# EAGLE schematic AK4493-v1.64_4 (EAGLE 9.6.2)
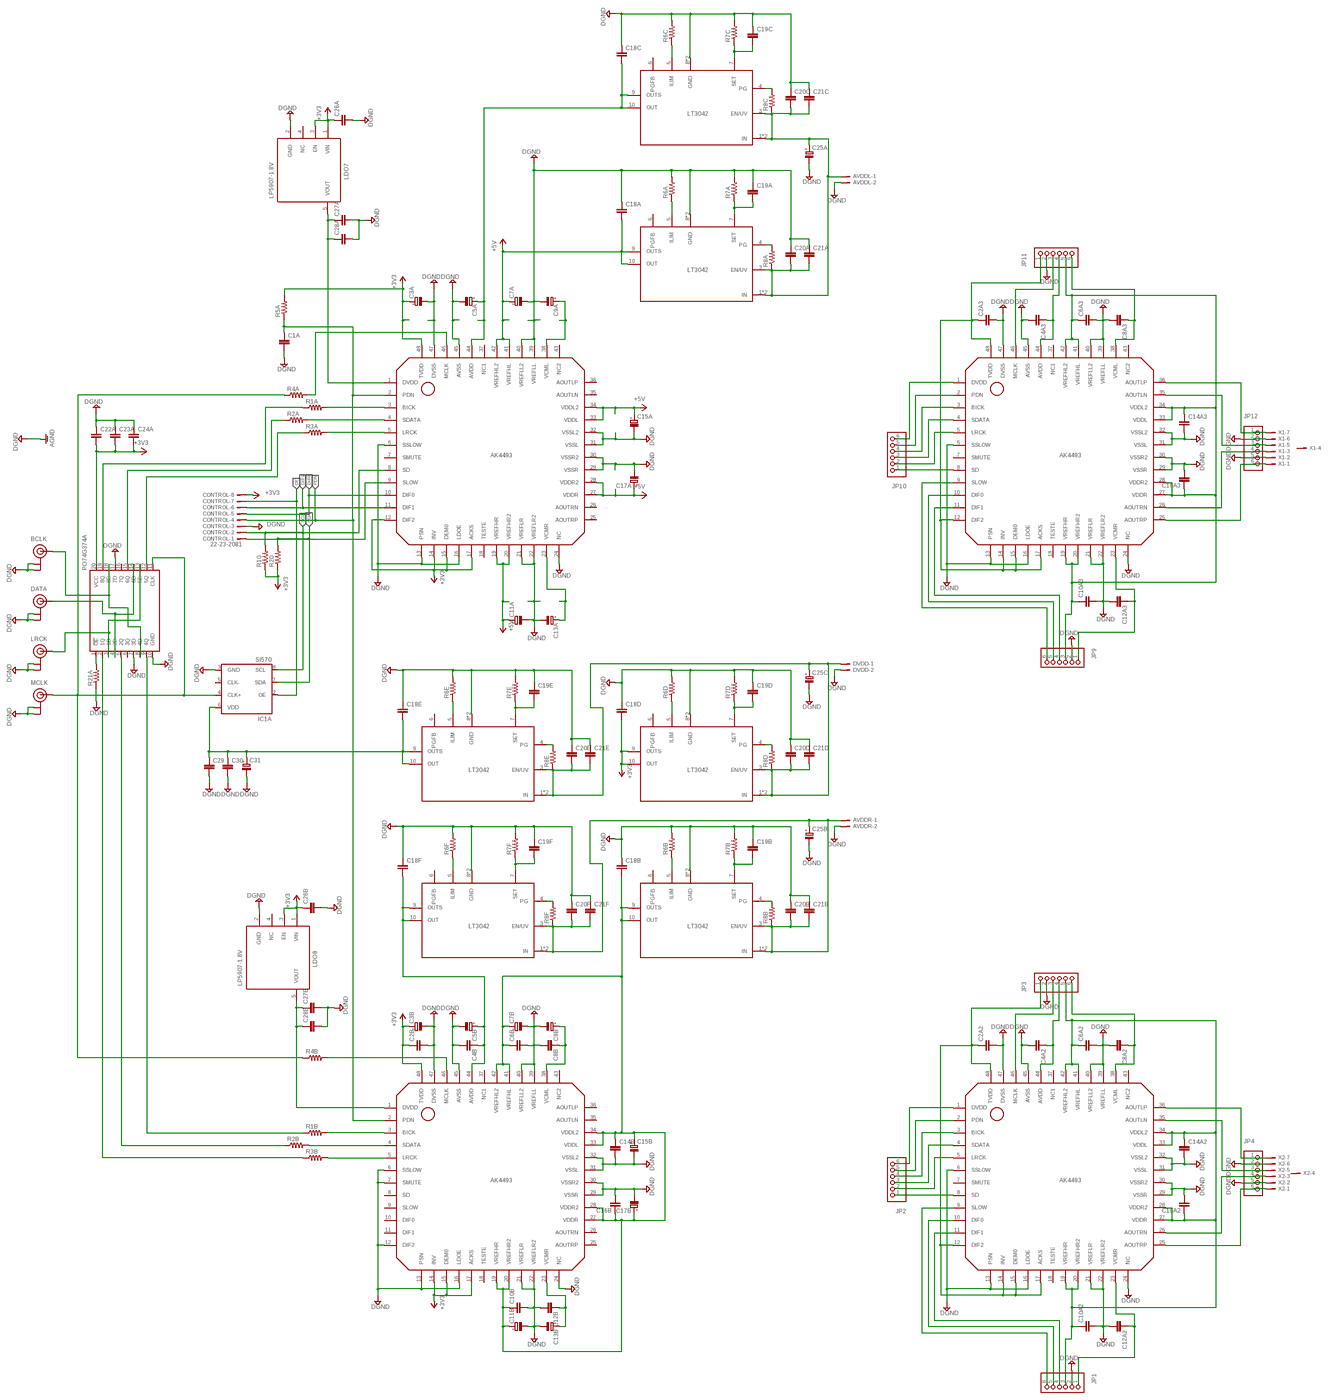
[diagram p0: schematic, sheet 1, overview]
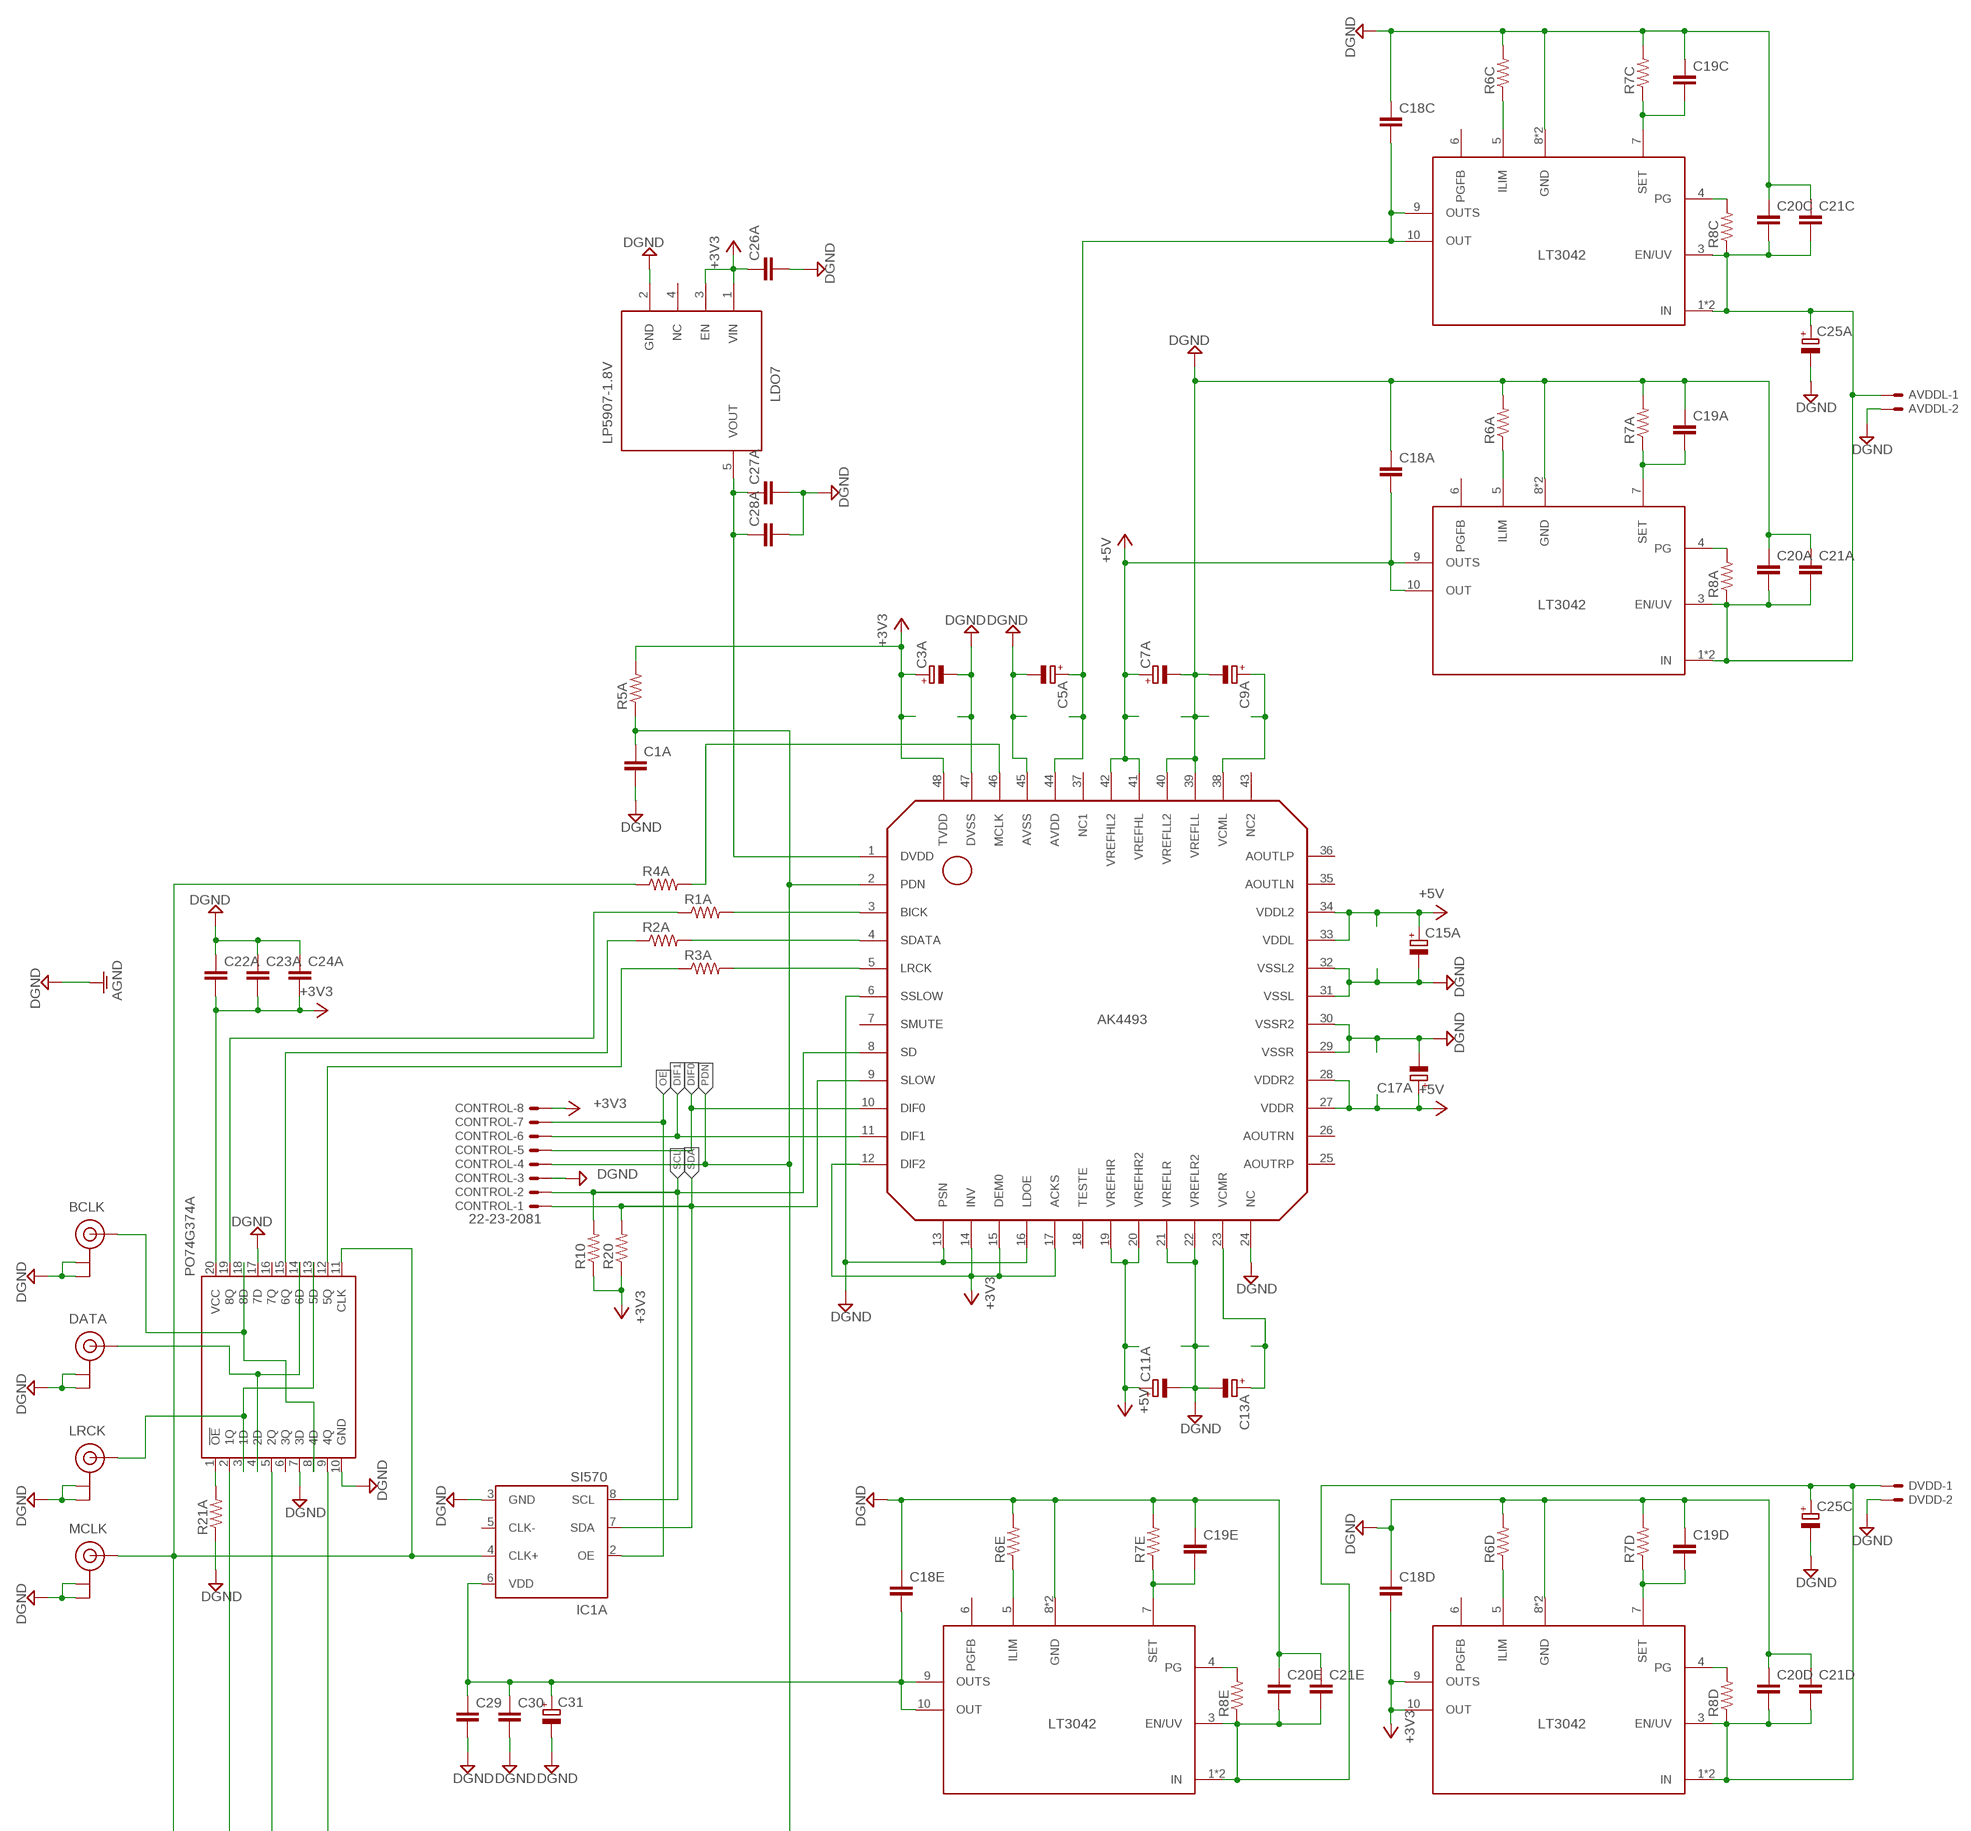
[diagram p1: schematic, sheet 1, part 1 of 4]
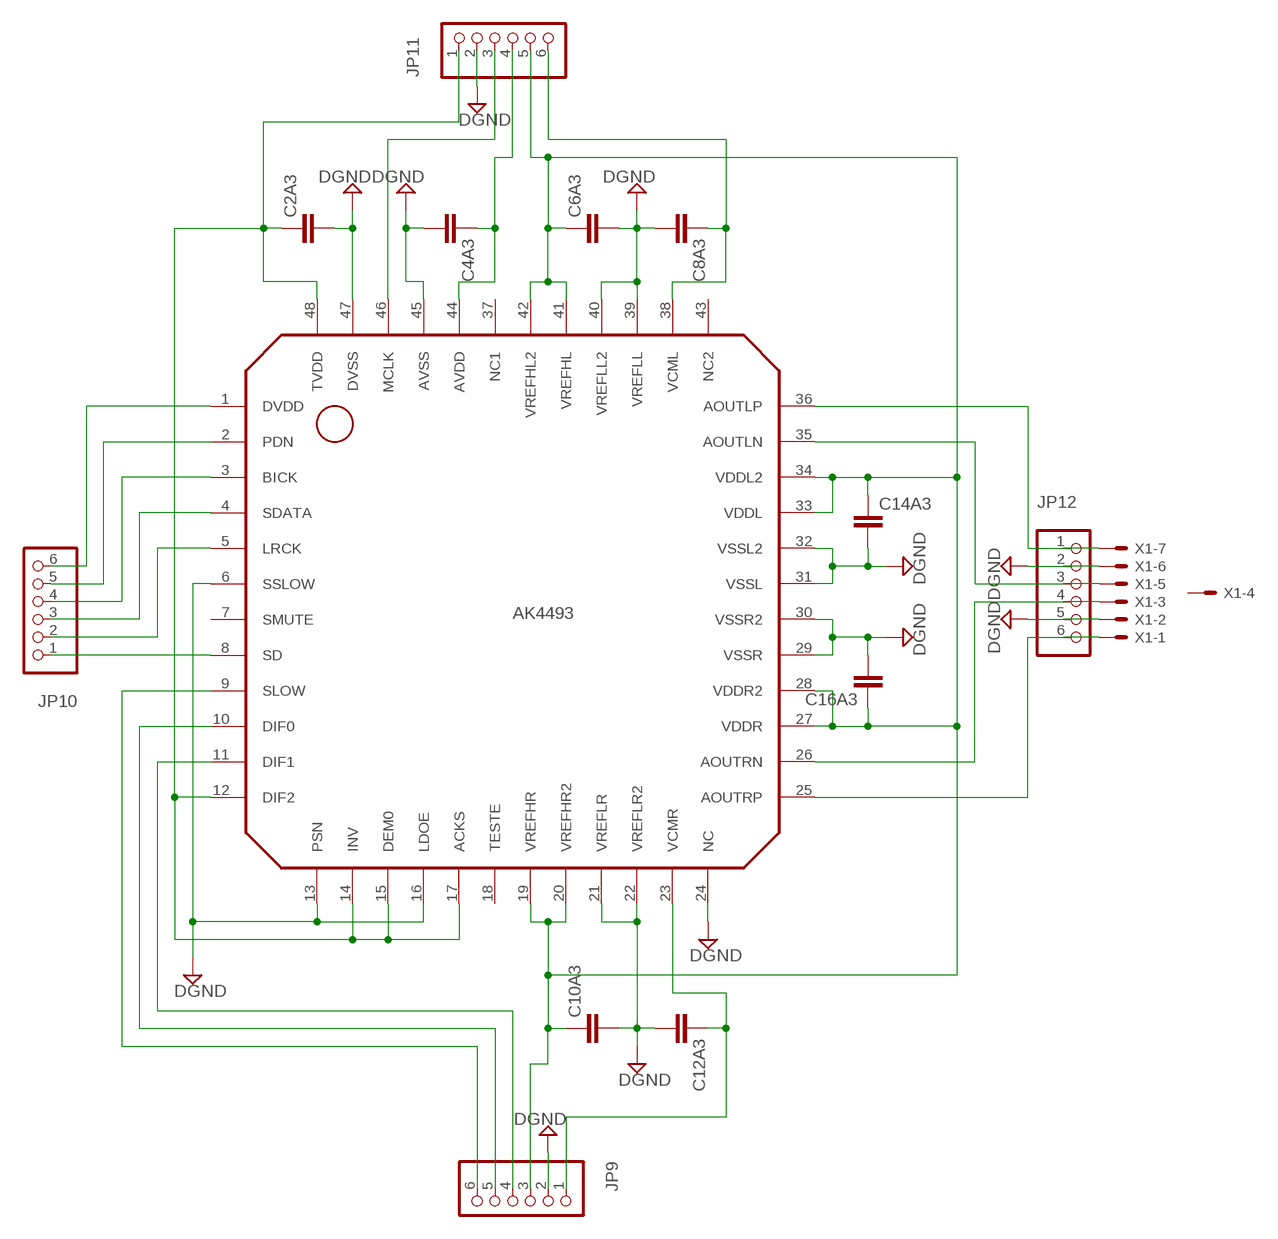
[diagram p2: schematic, sheet 1, part 2 of 4]
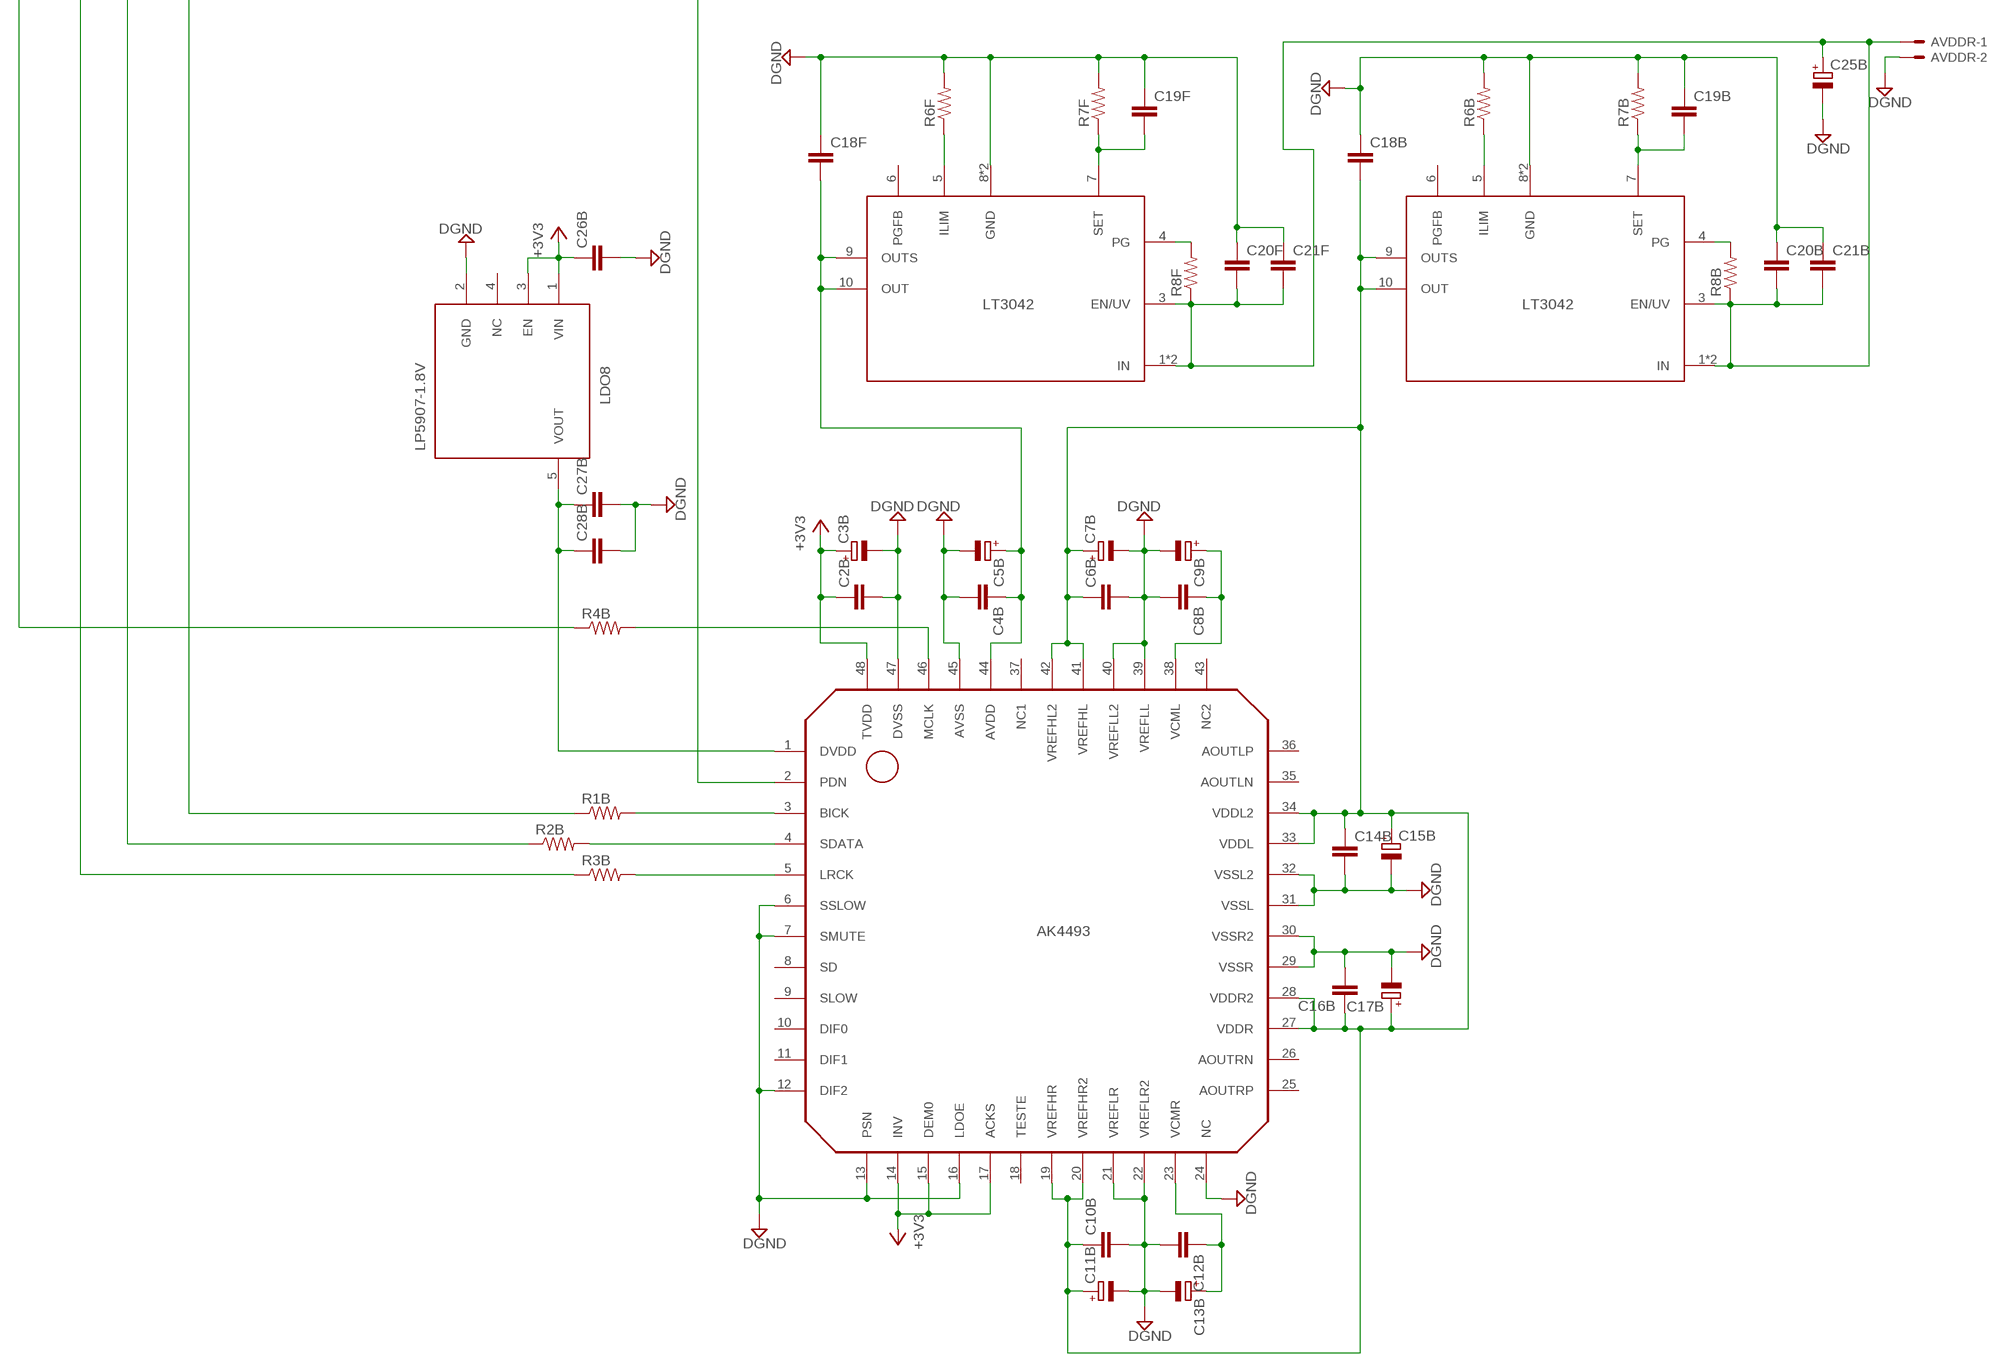
[diagram p3: schematic, sheet 1, part 3 of 4]
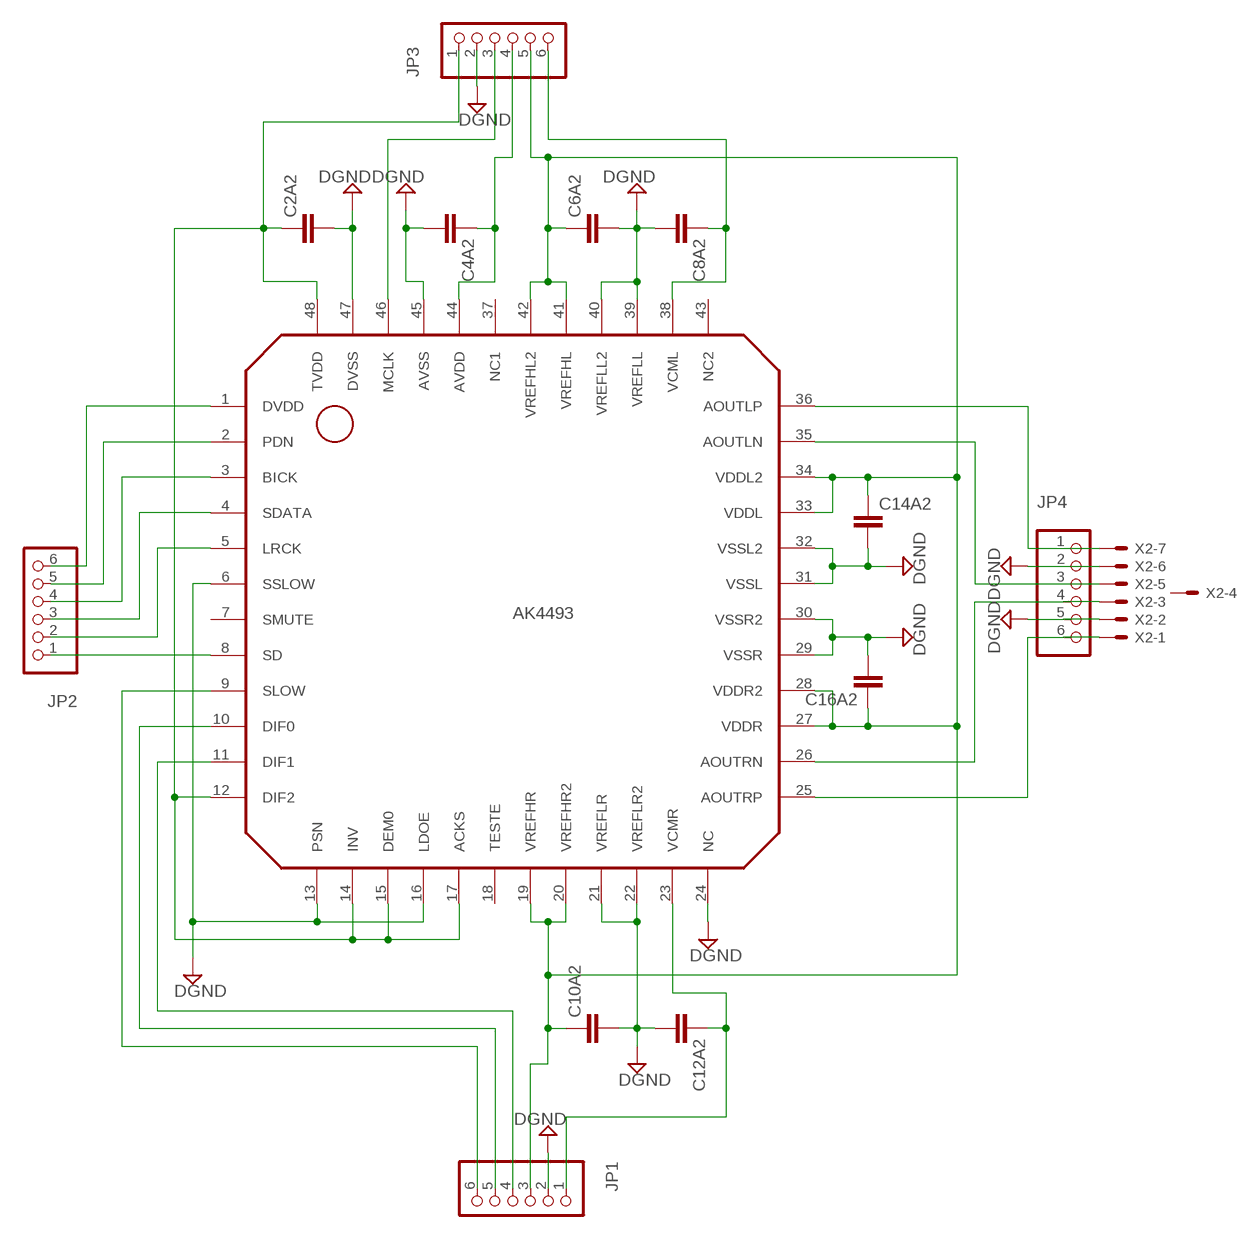
[diagram p4: schematic, sheet 1, part 4 of 4]

## Parts
AVDDL  22-23-2021  [22-23-2021]
AVDDR  22-23-2021  [22-23-2021]
BCLK  U.FL  [U.FL]
C1A  C-EUC0805K  [C0805K]
C2A2  C-EUC0201  [C0201]
C2A3  C-EUC0201  [C0201]
C2B  C-EUC0603K  [C0603K]
C3A  CPOL-EUE2.5-5  [E2,5-5]
C3B  CPOL-EUE2.5-5  [E2,5-5]
C4A2  C-EUC0201  [C0201]
C4A3  C-EUC0201  [C0201]
C4B  C-EUC0603K  [C0603K]
C5A  CPOL-EUE2.5-5  [E2,5-5]
C5B  CPOL-EUE2.5-5  [E2,5-5]
C6A2  C-EUC0201  [C0201]
C6A3  C-EUC0201  [C0201]
C6B  C-EUC0603K  [C0603K]
C7A  CPOL-EUE5-8.5  [E5-8,5]
C7B  CPOL-EUE5-8.5  [E5-8,5]
C8A2  C-EUC0201  [C0201]
C8A3  C-EUC0201  [C0201]
C8B  C-EUC0603K  [C0603K]
C9A  CPOL-EUE2-4  [E2-4]
C9B  CPOL-EUE2-4  [E2-4]
C10A2  C-EUC0201  [C0201]
C10A3  C-EUC0201  [C0201]
C10B  C-EUC0603K  [C0603K]
C11A  CPOL-EUE5-8.5  [E5-8,5]
C11B  CPOL-EUE5-8.5  [E5-8,5]
C12A2  C-EUC0201  [C0201]
C12A3  C-EUC0201  [C0201]
C12B  C-EUC0603K  [C0603K]
C13A  CPOL-EUE2-4  [E2-4]
C13B  CPOL-EUE2-4  [E2-4]
C14A2  C-EUC0201  [C0201]
C14A3  C-EUC0201  [C0201]
C14B  C-EUC0603K  [C0603K]
C15A  CPOL-EUE2-4  [E2-4]
C15B  CPOL-EUE2-4  [E2-4]
C16A2  C-EUC0201  [C0201]
C16A3  C-EUC0201  [C0201]
C16B  C-EUC0603K  [C0603K]
C17A  CPOL-EUE2-4  [E2-4]
C17B  CPOL-EUE2-4  [E2-4]
C18A  C-EUC0805K  [C0805K]
C18B  C-EUC0805K  [C0805K]
C18C  C-EUC0805K  [C0805K]
C18D  C-EUC0805K  [C0805K]
C18E  C-EUC0805K  [C0805K]
C18F  C-EUC0805K  [C0805K]
C19A  C-EUC1206K  [C1206K]
C19B  C-EUC1206K  [C1206K]
C19C  C-EUC1206K  [C1206K]
C19D  C-EUC1206K  [C1206K]
C19E  C-EUC1206K  [C1206K]
C19F  C-EUC1206K  [C1206K]
C20A  C-EUC0805K  [C0805K]
C20B  C-EUC0805K  [C0805K]
C20C  C-EUC0805K  [C0805K]
C20D  C-EUC0805K  [C0805K]
C20E  C-EUC0805K  [C0805K]
C20F  C-EUC0805K  [C0805K]
C21A  C-EUC0805K  [C0805K]
C21B  C-EUC0805K  [C0805K]
C21C  C-EUC0805K  [C0805K]
C21D  C-EUC0805K  [C0805K]
C21E  C-EUC0805K  [C0805K]
C21F  C-EUC0805K  [C0805K]
C22A  C-EUC0603K  [C0603K]
C23A  C-EUC0603K  [C0603K]
C24A  C-EUC0603K  [C0603K]
C25A  CPOL-EUE2.5-7  [E2,5-7]
C25B  CPOL-EUE2.5-7  [E2,5-7]
C25C  CPOL-EUE2.5-7  [E2,5-7]
C26A  C-EUC0805K  [C0805K]
C26B  C-EUC0805K  [C0805K]
C27A  C-EUC0805K  [C0805K]
C27B  C-EUC0805K  [C0805K]
C28A  C-EUC0603K  [C0603K]
C28B  C-EUC0603K  [C0603K]
C29  C-EUC0603K  [C0603K]
C30  C-EUC0805K  [C0805K]
C31  CPOL-EUE2.5-5  [E2,5-5]
CONTROL  22-23-2081  [22-23-2081]
DATA  U.FL  [U.FL]
DVDD  22-23-2021  [22-23-2021]
IC1  LT3042  [SOP50P490X110-11N]
IC1A  SI570  [8-PIN]
IC2  AK4493  [LQFP48]
IC3A  AK4493  [LQFP48]
IC4  LT3042  [SOP50P490X110-11N]
IC4A  PO74G374A  [SOP65P640X120-20N]
IC5  LT3042  [SOP50P490X110-11N]
IC6  LT3042  [SOP50P490X110-11N]
IC7  LT3042  [SOP50P490X110-11N]
IC8  LT3042  [SOP50P490X110-11N]
IC9  AK4493  [LQFP48]
IC10  AK4493  [LQFP48]
JP1  PINHD-1X6  [1X06]
JP2  PINHD-1X6  [1X06]
JP3  PINHD-1X6  [1X06]
JP4  PINHD-1X6  [1X06]
JP9  PINHD-1X6  [1X06]
JP10  PINHD-1X6  [1X06]
JP11  PINHD-1X6  [1X06]
JP12  PINHD-1X6  [1X06]
LDO7  LP5907-1.8V  [SOT95P280X145-5N]
LDO8  LP5907-1.8V  [SOT95P280X145-5N]
LRCK  U.FL  [U.FL]
MCLK  U.FL  [U.FL]
R1A  R-US_R0603  [R0603]
R1B  R-US_R0603  [R0603]
R2A  R-US_R0603  [R0603]
R2B  R-US_R0603  [R0603]
R3A  R-US_R0603  [R0603]
R3B  R-US_R0603  [R0603]
R4A  R-US_R0603  [R0603]
R4B  R-US_R0603  [R0603]
R5A  R-US_R0805  [R0805]
R6A  R-US_R0805  [R0805]
R6B  R-US_R0805  [R0805]
R6C  R-US_R0805  [R0805]
R6D  R-US_R0805  [R0805]
R6E  R-US_R0805  [R0805]
R6F  R-US_R0805  [R0805]
R7A  R-US_R0805  [R0805]
R7B  R-US_R0805  [R0805]
R7C  R-US_R0805  [R0805]
R7D  R-US_R0805  [R0805]
R7E  R-US_R0805  [R0805]
R7F  R-US_R0805  [R0805]
R8A  R-US_R0805  [R0805]
R8B  R-US_R0805  [R0805]
R8C  R-US_R0805  [R0805]
R8D  R-US_R0805  [R0805]
R8E  R-US_R0805  [R0805]
R8F  R-US_R0805  [R0805]
R10  R-US_R0805  [R0805]
R20  R-US_R0805  [R0805]
R21A  R-US_R0805  [R0805]
X1  22-23-2071  [22-23-2071]
X2  22-23-2071  [22-23-2071]

## Nets
+3V3: C2B.1 C3A.+ C3B.+ C18D.2 C22A.2 C23A.2 C24A.2 C26A.1 C26B.1 CONTROL.8 IC2.12(DIF2) IC2.14(INV) IC2.15(DEM0) IC2.17(ACKS) IC2.48(TVDD) IC3A.14(INV) IC3A.15(DEM0) IC3A.17(ACKS) IC3A.48(TVDD) IC4A.20(VCC) IC5.9(OUTS) IC5.10(OUT) LDO7.1(VIN) LDO7.3(EN) LDO8.1(VIN) LDO8.3(EN) R5A.2 R10.1 R20.1
+5V: C7A.+ C11A.+ C15A.+ C17A.+ C18A.2 IC2.19(VREFHR) IC2.20(VREFHR2) IC2.27(VDDR) IC2.28(VDDR2) IC2.33(VDDL) IC2.34(VDDL2) IC2.41(VREFHL) IC2.42(VREFHL2) IC8.9(OUTS) IC8.10(OUT)
DGND: AVDDL.2 AVDDR.2 BCLK.1(GND) BCLK.2(GND) C1A.2 C2A2.2 C2A3.2 C2B.2 C3A.- C3B.- C4A2.2 C4A3.2 C4B.2 C5A.- C5B.- C6A2.2 C6A3.2 C6B.2 C7A.- C7B.- C8A2.2 C8A3.2 C8B.2 C9A.- C9B.- C10A2.2 C10A3.2 C10B.2 C11A.- C11B.- C12A2.2 C12A3.2 C12B.2 C13A.- C13B.- C14A2.2 C14A3.2 C14B.2 C15A.- C15B.- C16A2.2 C16A3.2 C16B.2 C17A.- C17B.- C18A.1 C18B.1 C18C.1 C18D.1 C18E.1 C18F.1 C19A.1 C19B.1 C19C.1 C19D.1 C19E.1 C19F.1 C20A.1 C20B.1 C20C.1 C20D.1 C20E.1 C20F.1 C21A.1 C21B.1 C21C.1 C21D.1 C21E.1 C21F.1 C22A.1 C23A.1 C24A.1 C25A.- C25B.- C25C.- C26A.2 C26B.2 C27A.2 C27B.2 C28A.2 C28B.2 C29.2 C30.2 C31.- CONTROL.3 DATA.1(GND) DATA.2(GND) DVDD.2 IC1.8(GND) IC1.11(GND) IC1A.3(GND) IC2.6(SSLOW) IC2.13(PSN) IC2.16(LDOE) IC2.21(VREFLR) IC2.22(VREFLR2) IC2.24(NC) IC2.29(VSSR) IC2.30(VSSR2) IC2.31(VSSL) IC2.32(VSSL2) IC2.39(VREFLL) IC2.40(VREFLL2) IC2.45(AVSS) IC2.47(DVSS) IC3A.6(SSLOW) IC3A.7(SMUTE) IC3A.12(DIF2) IC3A.13(PSN) IC3A.16(LDOE) IC3A.21(VREFLR) IC3A.22(VREFLR2) IC3A.24(NC) IC3A.29(VSSR) IC3A.30(VSSR2) IC3A.31(VSSL) IC3A.32(VSSL2) IC3A.39(VREFLL) IC3A.40(VREFLL2) IC3A.45(AVSS) IC3A.47(DVSS) IC4.8(GND) IC4.11(GND) IC4A.7(3D) IC4A.10(GND) IC4A.17(7D) IC5.8(GND) IC5.11(GND) IC6.8(GND) IC6.11(GND) IC7.8(GND) IC7.11(GND) IC8.8(GND) IC8.11(GND) IC9.6(SSLOW) IC9.13(PSN) IC9.16(LDOE) IC9.21(VREFLR) IC9.22(VREFLR2) IC9.24(NC) IC9.29(VSSR) IC9.30(VSSR2) IC9.31(VSSL) IC9.32(VSSL2) IC9.39(VREFLL) IC9.40(VREFLL2) IC9.45(AVSS) IC9.47(DVSS) IC10.6(SSLOW) IC10.13(PSN) IC10.16(LDOE) IC10.21(VREFLR) IC10.22(VREFLR2) IC10.24(NC) IC10.29(VSSR) IC10.30(VSSR2) IC10.31(VSSL) IC10.32(VSSL2) IC10.39(VREFLL) IC10.40(VREFLL2) IC10.45(AVSS) IC10.47(DVSS) JP1.2 JP3.2 JP9.2 JP11.2 LDO7.2(GND) LDO8.2(GND) LRCK.1(GND) LRCK.2(GND) MCLK.1(GND) MCLK.2(GND) R6A.2 R6B.2 R6C.2 R6D.2 R6E.2 R6F.2 R7A.2 R7B.2 R7C.2 R7D.2 R7E.2 R7F.2 R21A.1
DIF0: CONTROL.5 IC2.10(DIF0)
DIF1: CONTROL.6 IC2.11(DIF1)
N$1: IC1A.4(CLK+) IC4A.11(CLK) MCLK.FEED(SIGNAL) R4A.1 R4B.1
N$2: IC10.26(AOUTRN) JP12.4 X1.3
N$3: IC9.26(AOUTRN) JP4.4 X2.3
N$4: IC4A.3(1D) IC4A.13(5D) LRCK.FEED(SIGNAL)
N$5: DATA.FEED(SIGNAL) IC4A.4(2D) IC4A.14(6D)
N$8: BCLK.FEED(SIGNAL) IC4A.8(4D) IC4A.18(8D)
N$17: JP4.5 X2.2 ; supply symbol labelled DGND
N$18: C9A.+ IC2.38(VCML)
N$19: IC2.5(LRCK) R3A.2
N$20: IC2.4(SDATA) R2A.2
N$21: IC2.3(BICK) R1A.2
N$22: IC2.46(MCLK) R4A.2
N$23: IC4A.19(8Q) R1A.1
N$24: IC4A.15(6Q) R2A.1
N$25: IC4A.12(5Q) R3A.1
N$26: IC3A.46(MCLK) R4B.2
N$27: IC3A.3(BICK) R1B.2
N$28: IC3A.4(SDATA) R2B.2
N$29: IC3A.5(LRCK) R3B.2
N$30: IC4A.9(4Q) R1B.1
N$31: IC4A.5(2Q) R2B.1
N$32: IC4A.2(1Q) R3B.1
N$33: IC4A.1(!OE) R21A.2
N$34: C6B.1 C7B.+ C10B.1 C11B.+ C14B.1 C15B.+ C16B.1 C17B.+ C18B.2 IC3A.19(VREFHR) IC3A.20(VREFHR2) IC3A.27(VDDR) IC3A.28(VDDR2) IC3A.33(VDDL) IC3A.34(VDDL2) IC3A.41(VREFHL) IC3A.42(VREFHL2) IC6.9(OUTS) IC6.10(OUT)
N$35: IC7.5(ILIM) R6C.1
N$36: C19C.2 IC7.7(SET) R7C.1
N$37: C27A.1 C28A.1 IC2.1(DVDD) LDO7.5(VOUT)
N$38: IC1.5(ILIM) R6F.1
N$39: IC7.4(PG) R8C.2
N$40: AVDDL.1 C20A.2 C20C.2 C21A.2 C21C.2 C25A.+ IC7.1(IN) IC7.2(IN) IC7.3(EN/UV) IC8.1(IN) IC8.2(IN) IC8.3(EN/UV) R8A.1 R8C.1
N$41: IC8.5(ILIM) R6A.1
N$42: C19A.2 IC8.7(SET) R7A.1
N$43: IC8.4(PG) R8A.2
N$44: JP4.2 X2.6 ; supply symbol labelled DGND
N$45: C5A.+ C18C.2 IC2.44(AVDD) IC7.9(OUTS) IC7.10(OUT)
N$46: C4B.1 C5B.+ C18F.2 IC1.9(OUTS) IC1.10(OUT) IC3A.44(AVDD)
N$47: C18E.2 C29.1 C30.1 C31.+ IC1A.6(VDD) IC4.9(OUTS) IC4.10(OUT)
N$48: IC4.5(ILIM) R6E.1
N$49: C19E.2 IC4.7(SET) R7E.1
N$50: IC4.4(PG) R8E.2
N$51: C12B.1 C13B.+ IC3A.23(VCMR)
N$52: C8B.1 C9B.+ IC3A.38(VCML)
N$53: C19F.2 IC1.7(SET) R7F.1
N$54: IC1.4(PG) R8F.2
N$57: IC5.5(ILIM) R6D.1
N$58: C19D.2 IC5.7(SET) R7D.1
N$59: IC5.4(PG) R8D.2
N$60: C20D.2 C20E.2 C21D.2 C21E.2 C25C.+ DVDD.1 IC4.1(IN) IC4.2(IN) IC4.3(EN/UV) IC5.1(IN) IC5.2(IN) IC5.3(EN/UV) R8D.1 R8E.1
N$61: IC6.5(ILIM) R6B.1
N$62: IC6.4(PG) R8B.2
N$63: AVDDR.1 C20B.2 C20F.2 C21B.2 C21F.2 C25B.+ IC1.1(IN) IC1.2(IN) IC1.3(EN/UV) IC6.1(IN) IC6.2(IN) IC6.3(EN/UV) R8B.1 R8F.1
N$64: C19B.2 IC6.7(SET) R7B.1
N$65: JP12.5 X1.2 ; supply symbol labelled DGND
N$66: C27B.1 C28B.1 IC3A.1(DVDD) LDO8.5(VOUT)
N$67: JP12.2 X1.6 ; supply symbol labelled DGND
N$70: C13A.+ IC2.23(VCMR)
N$77 [L_Audio]: IC9.35(AOUTLN) JP4.3 X2.5
N$80: IC9.8(SD) JP2.1
N$81: IC9.9(SLOW) JP1.6
N$82 [L_Audio]: IC10.36(AOUTLP) JP12.1 X1.7
N$83 [L_Audio]: IC10.35(AOUTLN) JP12.3 X1.5
N$84 [R_Audio]: IC10.25(AOUTRP) JP12.6 X1.1
N$85: IC9.11(DIF1) JP1.4
N$86: IC9.10(DIF0) JP1.5
N$87: IC9.5(LRCK) JP2.2
N$88: IC9.4(SDATA) JP2.3
N$89: IC9.3(BICK) JP2.4
N$90: IC9.46(MCLK) JP3.3
N$91: IC9.1(DVDD) JP2.6
N$92: C4A2.1 IC9.44(AVDD) JP3.4
N$93: IC9.2(PDN) JP2.5
N$94: C8A2.1 IC9.38(VCML) JP3.6
N$95: C12A2.1 IC9.23(VCMR) JP1.1
N$96: C2A2.1 IC9.12(DIF2) IC9.14(INV) IC9.15(DEM0) IC9.17(ACKS) IC9.48(TVDD) JP3.1
N$97: C6A2.1 C10A2.1 C14A2.1 C16A2.1 IC9.19(VREFHR) IC9.20(VREFHR2) IC9.27(VDDR) IC9.28(VDDR2) IC9.33(VDDL) IC9.34(VDDL2) IC9.41(VREFHL) IC9.42(VREFHL2) JP1.3 JP3.5
N$99 [L_Audio]: IC9.36(AOUTLP) JP4.1 X2.7
N$100: IC10.8(SD) JP10.1
N$101 [R_Audio]: IC9.25(AOUTRP) JP4.6 X2.1
N$102: IC10.9(SLOW) JP9.6
N$103: IC10.11(DIF1) JP9.4
N$104: IC10.10(DIF0) JP9.5
N$105: IC10.5(LRCK) JP10.2
N$106: IC10.4(SDATA) JP10.3
N$107: IC10.3(BICK) JP10.4
N$108: IC10.46(MCLK) JP11.3
N$109: IC10.1(DVDD) JP10.6
N$110: C4A3.1 IC10.44(AVDD) JP11.4
N$111: IC10.2(PDN) JP10.5
N$112: C8A3.1 IC10.38(VCML) JP11.6
N$113: C12A3.1 IC10.23(VCMR) JP9.1
N$114: C2A3.1 IC10.12(DIF2) IC10.14(INV) IC10.15(DEM0) IC10.17(ACKS) IC10.48(TVDD) JP11.1
N$115: C6A3.1 C10A3.1 C14A3.1 C16A3.1 IC10.19(VREFHR) IC10.20(VREFHR2) IC10.27(VDDR) IC10.28(VDDR2) IC10.33(VDDL) IC10.34(VDDL2) IC10.41(VREFHL) IC10.42(VREFHL2) JP9.3 JP11.5
OE: CONTROL.7 IC1A.2(OE)
PDN: C1A.1 CONTROL.4 IC2.2(PDN) IC3A.2(PDN) R5A.1
SCL: CONTROL.2 IC1A.8(SCL) IC2.8(SD) R10.2
SDA: CONTROL.1 IC1A.7(SDA) IC2.9(SLOW) R20.2
Unconnected: IC1.6(PGFB) IC1A.5(CLK-) IC2.7(SMUTE) IC2.18(TESTE) IC2.25(AOUTRP) IC2.26(AOUTRN) IC2.35(AOUTLN) IC2.36(AOUTLP) IC2.37(NC1) IC2.43(NC2) IC3A.8(SD) IC3A.9(SLOW) IC3A.10(DIF0) IC3A.11(DIF1) IC3A.18(TESTE) IC3A.25(AOUTRP) IC3A.26(AOUTRN) IC3A.35(AOUTLN) IC3A.36(AOUTLP) IC3A.37(NC1) IC3A.43(NC2) IC4.6(PGFB) IC4A.6(3Q) IC4A.16(7Q) IC5.6(PGFB) IC6.6(PGFB) IC7.6(PGFB) IC8.6(PGFB) IC9.7(SMUTE) IC9.18(TESTE) IC9.37(NC1) IC9.43(NC2) IC10.7(SMUTE) IC10.18(TESTE) IC10.37(NC1) IC10.43(NC2) LDO7.4(NC) LDO8.4(NC) X1.4 X2.4

## Library data of the parts
AVDDL AVDDR DVDD = con-molex:22-23-2021: .100" (2.54mm) Center Header - 2 Pin; MF: MOLEX; MPN: 22-23-2021; OC_FARNELL: 1462926; OC_NEWARK: 25C3832
BCLK DATA LRCK MCLK = SparkFun-Connectors:U.FL: SMD Antenna Connector - U.FL 2mm height, 3.0mm x 3.0mm receptacle size. SparkFun Products: SparkFun WiFi Shield - ESP8266 <https://www.sparkfun.com/products/13287> SparkFun ESP8266 Thing <https://www.sparkfun.com/products/13231> SparkFun MiniGen - Pro Mini Signal Generator Shield <https://www.sparkfun.com/products/11420>; PROD_ID: CONN-09193; SF_ID: WRL-09144
C1A C2A2 C2A3 C2B C4A2 C4A3 C4B C6A2 C6A3 C6B C8A2 C8A3 C8B C10A2 C10A3 C10B C12A2 C12A3 C12B C14A2 C14A3 C14B C16A2 C16A3 C16B C18A C18B C18C C18D C18E C18F C19A C19B C19C C19D C19E C19F C20A C20B C20C C20D C20E C20F C21A C21B C21C C21D C21E C21F C22A C23A C24A C26A C26B C27A C27B C28A C28B C29 C30 = rcl:C-EU: CAPACITOR, European symbol; SPICEPREFIX: C
C3A C3B C5A C5B C7A C7B C9A C9B C11A C11B C13A C13B C15A C15B C17A C17B C25A C25B C25C C31 = rcl:CPOL-EU: POLARIZED CAPACITOR, European symbol; SPICEPREFIX: C
CONTROL = con-molex:22-23-2081: .100" (2.54mm) Center Header - 8 Pin; MF: MOLEX; MPN: 22-23-2081; OC_FARNELL: 1756826; OC_NEWARK: 01C7592
IC1 IC4-IC8 = LT3042EMSE#PBF:LT3042: LINEAR TECHNOLOGY - LT3042EMSE#PBF - LDO, ADJ, 0.2A, 0V-15V, MSOP-10 Source: Datasheet <http://www.linear.com/docs/46159>; DESCRIPTION: LINEAR TECHNOLOGY - LT3042EMSE#PBF - LDO, ADJ, 0.2A, 0V-15V, MSOP-10; HEIGHT: 1.1mm; MANUFACTURER_NAME: Linear Technology; MANUFACTURER_PART_NUMBER: LT3042EMSE#PBF; MOUSER_PART_NUMBER: 584-LT3042EMSE#PBF; MOUSER_PRICE-STOCK: https://www.mouser.co.uk/ProductDetail/Analog-Devices-Linear-Technology/LT3042EMSEPBF?qs=oahfZPh6IAJ3XP16d20ITw%3D%3D
IC1A = silabs:SI570: ANY-RATE I2C PROGRAMMABLE XO/VCXO Source: si570.pdf; OC_FARNELL: unknown; OC_NEWARK: unknown
IC2 IC3A IC9 IC10 = akm:AK4493: Quality Oriented 32-Bit 2ch DAC 32-Bit, 768 kHz with VELVET SOUND
IC4A = PO74G374A:PO74G374A
JP1-JP4 JP9-JP12 = pinhead:PINHD-1X6: PIN HEADER
LDO7 LDO8 = LP5907-1.8V:LP5907-1.8V: 250-mA ultra-low-noise low-IQ low-dropout (LDO) linear regulator Source: Datasheet <http://www.ti.com/lit/gpn/lp5907>; ARROW_PART_NUMBER: LP5907MFX-1.8/NOPB; ARROW_PRICE-STOCK: https://www.arrow.com/en/products/lp5907mfx-1.8nopb/texas-instruments?region=nac; DESCRIPTION: 250-mA ultra-low-noise low-IQ low-dropout (LDO) linear regulator; HEIGHT: 1.45mm; MANUFACTURER_NAME: Texas Instruments; MANUFACTURER_PART_NUMBER: LP5907MFX-1.8/NOPB; MOUSER_PART_NUMBER: 595-LP5907MFX-1.8NPB; MOUSER_PRICE-STOCK: https://www.mouser.co.uk/ProductDetail/Texas-Instruments/LP5907MFX-1.8-NOPB?qs=biyDIajrTn5jh5ArkSZeqw%3D%3D
R1A R1B R2A R2B R3A R3B R4A R4B R5A R6A R6B R6C R6D R6E R6F R7A R7B R7C R7D R7E R7F R8A R8B R8C R8D R8E R8F R10 R20 R21A = rcl:R-US_: RESISTOR, American symbol; SPICEPREFIX: R
X1 X2 = con-molex:22-23-2071: .100" (2.54mm) Center Header - 7 Pin; MF: MOLEX; MPN: 22-23-2071; OC_FARNELL: 1654534; OC_NEWARK: 56H0445